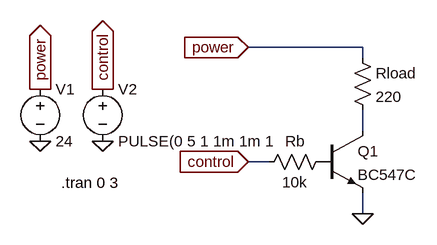
[diagram p0: schematic switch-npn.asc]
switch-npn.asc, the LTspice schematic file:
Version 4
SHEET 1 880 680
WIRE 240 80 64 80
WIRE 240 96 240 80
WIRE 240 208 240 176
WIRE 96 256 64 256
WIRE 240 336 240 304
FLAG 240 336 0
FLAG 64 256 control
IOPIN 64 256 In
FLAG 64 80 power
IOPIN 64 80 In
FLAG -256 224 0
FLAG -256 144 power
IOPIN -256 144 Out
FLAG -160 224 0
FLAG -160 144 control
IOPIN -160 144 Out
SYMBOL npn 176 208 R0
SYMATTR InstName Q1
SYMATTR Value BC547C
SYMBOL Res 224 80 R0
SYMATTR InstName Rload
SYMATTR Value 220
SYMBOL Res 192 240 R90
WINDOW 0 0 56 VBottom 2
WINDOW 3 32 56 VTop 2
SYMATTR InstName Rb
SYMATTR Value 10k
SYMBOL Voltage -256 128 R0
SYMATTR InstName V1
SYMATTR Value 24
SYMBOL Voltage -160 128 R0
SYMATTR InstName V2
SYMATTR Value PULSE(0 5 1 1m 1m 1
TEXT -224 288 Left 2 !.tran 0 3

The netlist it stands for:
* switch-npn.asc
Q1 N001 P001 0 0 BC547C
Rload power N001 220
Rb P001 control 10k
V1 power 0 24
V2 control 0 PULSE(0 5 1 1m 1m 1
.model NPN NPN
.model PNP PNP
.lib standard.bjt
.tran 0 3
.backanno
.end